# EasyEDA Pro project ProPrj_WatcheRobot2.0openSource_2026-06-17.epro, board 脚底充电板PCB
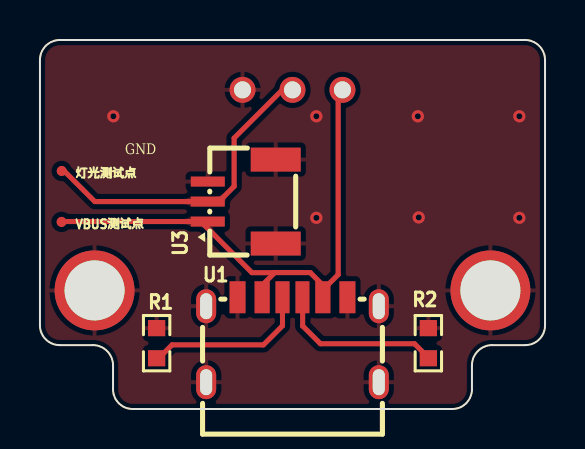
[diagram p6: board, top side]
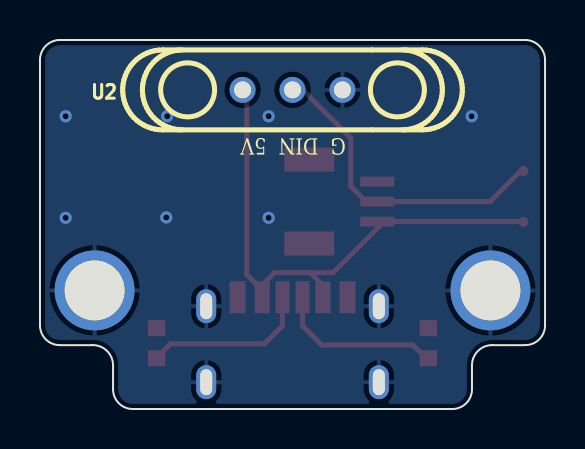
[diagram p7: board, bottom side, seen from below]

Outline 25.28 x 18.46 mm; copper layers: Top Layer, Bottom Layer. Coordinates in mm from the lower left corner of the outline.
Outline path: 0,17.46 arc(0.29,18.17) 1,18.46 24.28,18.46 arc(24.99,18.17) 25.28,17.46 25.28,4.19 arc(24.99,3.49) 24.29,3.2 22.63,3.2 arc(21.92,2.9) 21.62,2.19 21.62,0.99 arc(21.33,0.29) 20.63,0 4.65,0 arc(3.95,0.29) 3.66,0.99 3.66,2.19 arc(3.36,2.9) 2.65,3.2 0.99,3.2 arc(0.29,3.49) 0,4.19 0,17.46
Stack: Top Layer 0.035mm / Dielectric1 1.51mm FR4 er 4.5 / Bottom Layer 0.035mm

## Design rules (mm)
spacing copperThickness1oz (default): track to track 0.102, other pairs 0.152 to 0.3
spacing copperThickness2oz: track to track 0.203, other pairs 0.152 to 0.3
track width copperThickness1oz (default): min 0.127, default 0.254, max 2.54
track width copperThickness2oz: min 0.203, default 0.254, max 2.54
differential pair differentialPair (default): width min 0.127, default 0.254, max 2.54; gap min 0.152, default 0.152
net GND uses copperRegion

## Placement (name value [footprint] x y rotation side)
NOREF  -  [Pad_e23]  2.73 5.93 0 top
NOREF#2  -  [Pad_e24]  22.55 5.93 0 top
R1  5.1kΩ  [R0603_3]  5.84 3.29 270 top
R2  5.1kΩ  [R0603_3]  19.44 3.29 270 top
U1  YTC-TC6-268  [TYPE-C-SMD_YIYUAN_YTC-TC6-268]  12.64 3.47 0 top
U2  PR5L4015-3P-C-F  [CONN-TH_PR5L4015-3P-C-F]  12.64 15.97 180 bottom
U3  ZX-SH1.0-3PWT  [CONN-SMD_3P-P1.00_MEGASTAR_ZX-SH1.0-3PWT]  10.1 10.38 90 top
VBUS测试点  -  [Test-Point-0.5mm]  1.08 9.36 0 top
灯光测试点  -  [Test-Point-0.5mm]  1.09 11.91 0 top

## Footprints (pads in the part's own frame, mm; a bottom-side part is the same pattern mirrored in y, then rotated)
CONN-SMD_3P-P1.00_MEGASTAR_ZX-SH1.0-3PWT
  rect 0.5x1.7 smd: 1(-1,1.7) 2(0,1.7) 3(1,1.7)
  rect 1.2x2.5 smd: 4(-2.1,-1.7) 5(2.1,-1.7)
CONN-TH_PR5L4015-3P-C-F
  round 1.3 hole 0.85: 1(-2.5,0) 2(0,0) 3(2.5,0)
Pad_e23
  round 4 hole 3: (0,0)
Pad_e24
  round 4 hole 3: (0,0)
R0603_3
  rect 0.806x0.864 smd: 1(-0.753,0) 2(0.753,0)
Test-Point-0.5mm
  round 0.5 smd: 1(0,0)
TYPE-C-SMD_YIYUAN_YTC-TC6-268
  oval 1x1.7 hole 0.6x1.3: 1(-4.32,1.675) 2(4.32,1.675) 3(4.32,-2.124) 4(-4.32,-2.124)
  rect 0.7x1.6 smd: A5(-0.5,2.124) B5(0.5,2.124)
  rect 0.76x1.6 smd: A9(1.52,2.124) B9(-1.52,2.124)
  rect 0.8x1.6 smd: A12(2.75,2.124) B12(-2.75,2.124)

## Nets
As in the schematic, except:
GND: NOREF. NOREF#2. R1.1 R2.1 U1.1 U1.2 U1.3 U1.4 U1.A12 U1.B12 U2.3 U3.3 U3.4 U3.5

## Via types
v1: diameter 0.61, hole 0.305, Top Layer to Bottom Layer, 7 vias

## Routing (per net, layer and track width the routed paths; a pad name or vN(x,y) marks a point on that pad's centre or on a via; arc(x,y) is an arc through that point)
GND:
  vias: v1(3.67,14.65) v1(13.83,14.65) v1(13.83,9.57) v1(18.91,14.65) v1(18.96,9.59) v1(23.99,14.65) v1(23.99,9.57)
VCC_5V: length 27.3
  Top Layer w0.254: 14.16,5.96 14.16,6.19 13.53,6.82 11.75,6.82 ; 14.16,5.96 U1.A9 ; 14.16,5.96 14.93,6.72 14.93,15.75 U2.1 ; 1.08,9.24 1.23,9.38 8.05,9.38 10.61,6.82 11.75,6.82 11.12,6.19 11.12,5.21
WS2812_BOTTOM_DIN: length 16
  Top Layer w0.254: 1.09,12.03 2.75,10.38 8.96,10.38 9.72,11.14 9.72,13.55 12.13,15.97 U2.2
$1N31: length 8.3
  Top Layer w0.254: 13.14,5.21 13.15,5.2 13.15,4.16 14.04,3.27 18.74,3.27 19.62,2.39
$1N32: length 8.1
  Top Layer w0.254: 12.14,5.21 12.14,4.16 11.19,3.21 6.61,3.21 5.79,2.39

## Copper pours and planes (outline as drawn; the poured copper is in the pictures)
GND on Top Layer: -1.2,19.52 26.48,19.52 26.48,-2.45 -1.2,-2.45
GND on Bottom Layer: -1.58,20.03 27.88,20.03 27.88,-1.3 -1.58,-1.3

Small or netless copper shapes (teardrops, artwork), in the pictures only: 4 on Top Layer

## Text on the board
Bottom Silkscreen Layer: G  DIN  5V
Top Silkscreen Layer: GND
